# Altium schematic sheet P1234.01_TopLevel.SchDoc
size A3; SheetNumber: 1; SheetTotal: 3; Sheet_Title: Top Level
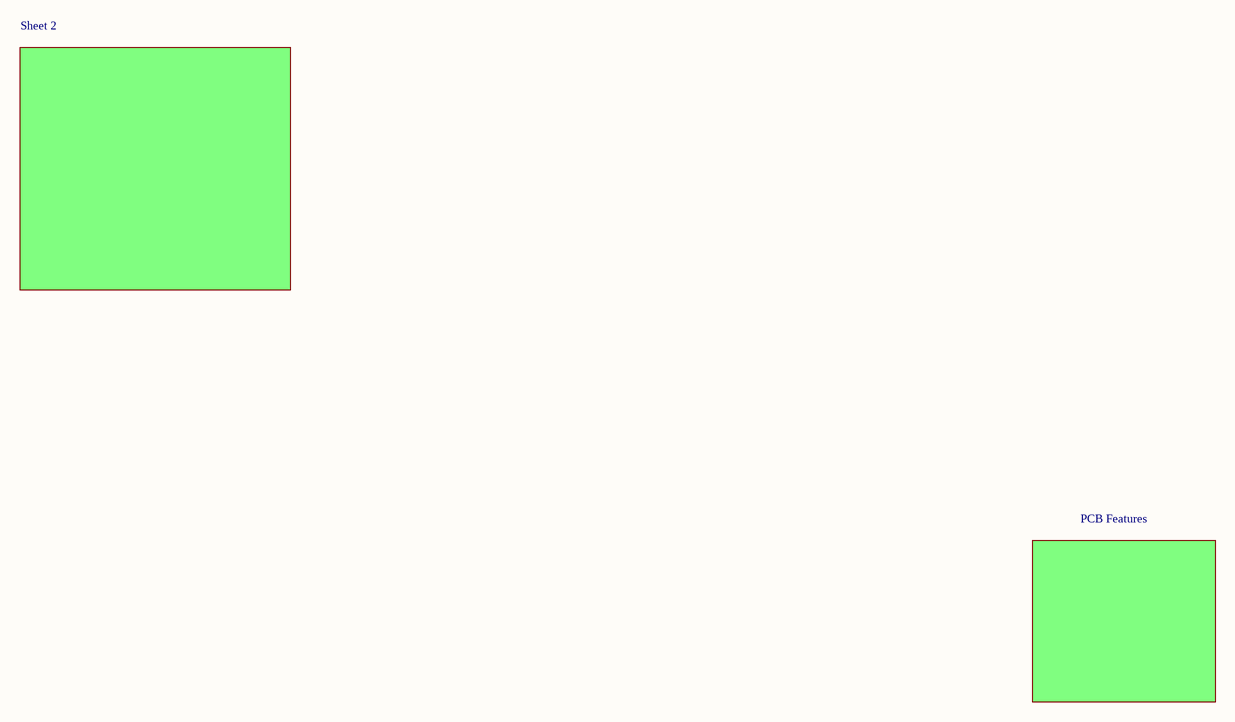
[diagram p0: P1234.01_TopLevel.SchDoc]

## Sub-sheets
PCB Features = P1234.01_A1_Schematic Sheet 3 of 3.SchDoc: no entries
Sheet 2 = P1234.01_A1_Schematic Sheet 2 of 3.SchDoc: no entries

## Notes on the sheet
- Client / Project
- Issue
- ECR
- Number
- Title
- Date
- App'd
- Sheet
- Must Not Be Modified
- Without Authorisation
- Certification Drawing
- Values shown are typical, see BOM table for certification details
- !
- DENOTES SAFETY COMPONENT
- Dr'n
- TROLEX Ltd
- Newby Road, Stockport, Cheshire SK7 5DY  U.K.
- Ch'kd
- Tel: +44 (0)161-483-1435  Web:www.trolex.com  Email: info@trolex.com
- No.
- Of